# EAGLE design srxe (EAGLE 9.0.1)
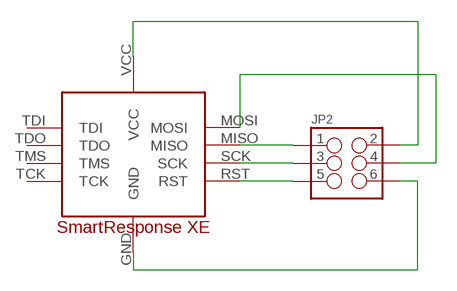
[diagram p0: schematic, sheet 1]

## Parts
JP2  M03X2FEMALE_SMD  [2X3_SMD]
U$1  SMARTRESPONSEXE  [SMARTRESPONSEXEPOGO]

## Nets
GND: JP2.6 U$1.GND
MISO: JP2.1 U$1.MISO
MOSI: JP2.4 U$1.MOSI
RST: JP2.5 U$1.RST
SCK: JP2.3 U$1.SCK
VCC: JP2.2 U$1.VCC
Unconnected: U$1.TCK U$1.TDI U$1.TDO U$1.TMS

## Library data of the parts
JP2 = SparkFun-Connectors:M03X2: 2x3 .1" header. Shrouded, with keying- CONN-10681 SMT- CONN-11415 Pogo pins- HW-11044; PROD_ID: CONN-11290
U$1 = smartresponse:SMARTRESPONSEXE

## Net classes
0 default: width 0.254 mm

## Board
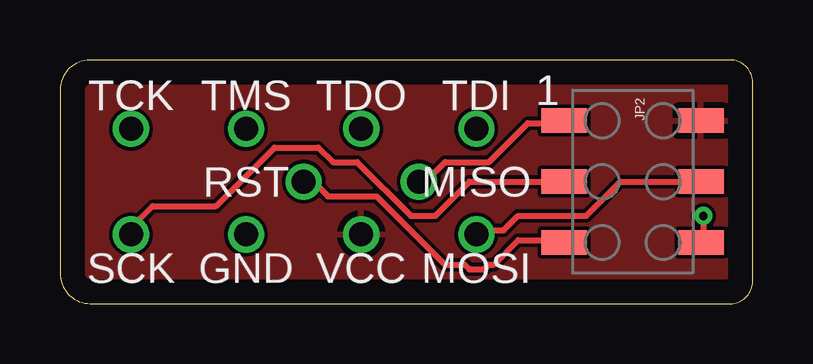
[diagram p1: board, top side]
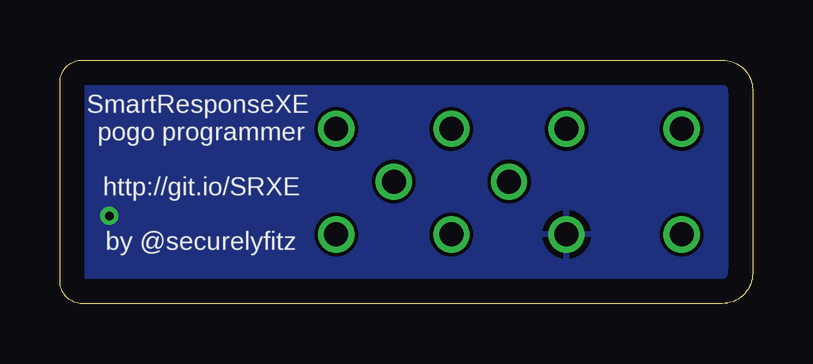
[diagram p2: board, bottom side, seen from below]

Size 28.88 x 10.15 mm. Coordinates in mm from the lower left corner, seen from the top.
Outline: 0,8.89 0,1.27 arc90 1.27,0 27.94,0 arc90 28.88,0.94 28.88,9.21 arc90 27.94,10.15 1.26,10.15 arc90 0,8.89
Copper layers (1*16): Top 0.035mm / dielectric 1.5mm / Bottom 0.035mm
Design rules "default": minimum track width 6mil, minimum drill 0.35mm, track to track 6mil, track to pad 6mil, pad to pad 6mil, via to via 6mil, smd to smd 6mil, copper to edge 40mil, drill to drill 6mil, minimum pad ring 10mil, minimum via ring 8mil, stop-mask expansion 4mil, vias tented up to drill 0mil, thermal gap 10mil

### Footprints (pad centres in the part's own frame; a part is rotated, then mirrored left to right if it is on the bottom)
2X3_SMD = smd 1.02 x 1.9: 1 -2.54,-2.85; 2 -2.54,2.85; 3 0,-2.85; 4 0,2.85; 5 2.54,-2.85; 6 2.54,2.85
SMARTRESPONSEXEPOGO = drill 1: GND -2.4,-2.2; MISO 4.8,0; MOSI 7.2,-2.2; RST 0,0; SCK -7.2,-2.2; TCK -7.2,2.2; TDI 7.2,2.2; TDO 2.4,2.2; TMS -2.4,2.2; VCC 2.4,-2.2

### Placement (x,y rotation side)
JP2  23.88,5.08 270 top
U$1  10.16,5.08 0 top

### Tracks (layer width: path | path; a pad name or v marks a point on that pad's centre or on a via)
GND  (via drill 0.35)
  Top 0.254: v26.82,3.66 26.82,2.64 JP2.6
  pour Bottom: -2.54,-2.54 -2.54,12.7 30.48,12.7 30.48,-2.54
MISO
  Top 0.254: U$1.MISO 15.24,5.08 16.05,5.89 17.88,5.89 19.51,7.52 20.93,7.52 JP2.1
MOSI
  Top 0.254: JP2.4 23.37,5.08 21.95,3.66 19.1,3.66 18.49,3.05 17.48,3.05 U$1.MOSI
RST
  Top 0.254: U$1.RST 10.57,5.08 11.18,4.47 13.21,4.47 16.05,1.63 16.87,1.63 17.07,1.42 17.68,1.42 17.88,1.63 18.09,1.63 19.1,2.64 20.93,2.64 JP2.5
SCK
  Top 0.254: JP2.3 17.07,5.08 15.65,3.66 14.63,3.66 12.39,5.89 11.38,5.89 10.77,6.5 8.94,6.5 6.5,4.06 3.86,4.06 2.85,3.05 U$1.SCK
VCC
  pour Top: -2.54,-2.54 -2.54,12.7 30.48,12.7 30.48,-2.54

### Text on the board
tNames: 1
bNames: SmartResponseXE / pogo programmer / / http://git.io/SRXE / / by @securelyfitz